# EAGLE design CVI06A (EAGLE 6.5.0)
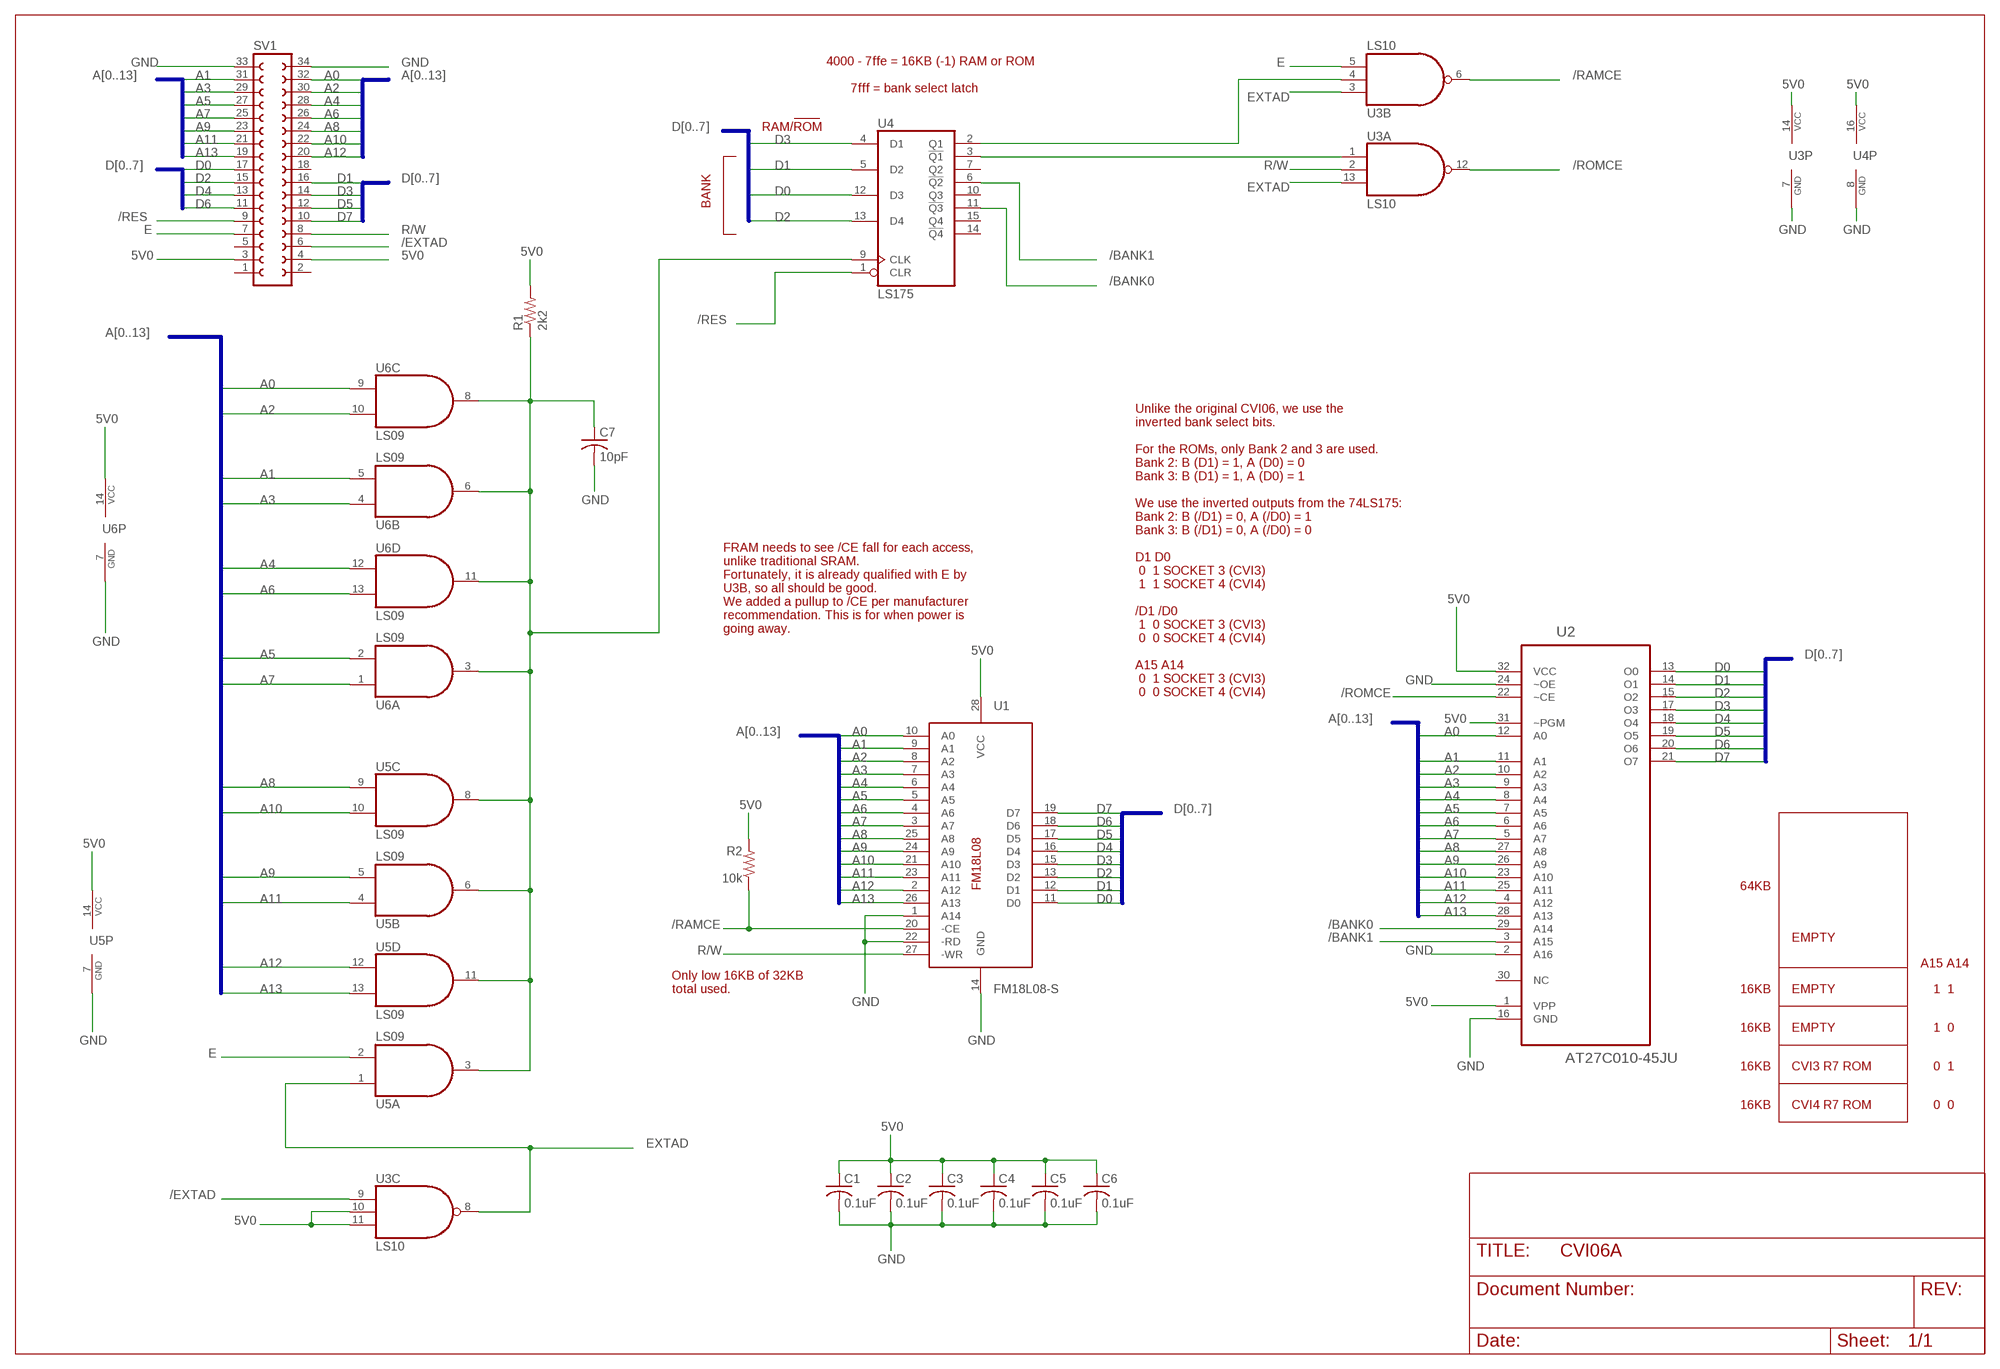
[diagram p0: schematic, sheet 1]

## Parts
C1  0.1uF  C-USC0603K  [C0603K]
C2  0.1uF  C-USC0603K  [C0603K]
C3  0.1uF  C-USC0603K  [C0603K]
C4  0.1uF  C-USC0603K  [C0603K]
C5  0.1uF  C-USC0603K  [C0603K]
C6  0.1uF  C-USC0603K  [C0603K]
C7  10pF  C-USC0805  [C0805]
R1  2k2  R-US_R0805  [R0805]
R2  10k  R-US_R0805  [R0805]
SV1  FE17-2  [FE17-2]
U1  FM18L08-S  [SO-28W]
U2  AT27C010-45JU  [PLCC127P1500X1250X355-32N]
U3  LS10  74ALS10D  [SO14]
U4  LS175  74LS175D  [SO16]
U5  LS09  74ALS09D  [SO14]
U6  LS09  74ALS09D  [SO14]

## Nets
5V0: C1.1 C2.1 C3.1 C4.1 C5.1 C6.1 R1.2 R2.2 SV1.3 SV1.4 U1.28(VCC) U2.1(VPP) U2.31(~PGM) U2.32(VCC) U3.10(C:I1) U3.11(C:I2) U3.14(P:VCC) U4.16(VCC) U5.14(P:VCC) U6.14(P:VCC)
/BANK0: U2.29(A14) U4.11(!Q3)
/BANK1: U2.3(A15) U4.6(!Q2)
/EXTAD: SV1.6 U3.9(C:I0)
/RAMCE: R2.1 U1.20(-CE) U3.6(B:O)
/RES: SV1.9 U4.1(CLR)
/ROMCE: U2.22(~CE) U3.12(A:O)
A0: SV1.32 U1.10(A0) U2.12(A0) U6.9(C:I0)
A1: SV1.31 U1.9(A1) U2.11(A1) U6.5(B:I1)
A2: SV1.30 U1.8(A2) U2.10(A2) U6.10(C:I1)
A3: SV1.29 U1.7(A3) U2.9(A3) U6.4(B:I0)
A4: SV1.28 U1.6(A4) U2.8(A4) U6.12(D:I0)
A5: SV1.27 U1.5(A5) U2.7(A5) U6.2(A:I1)
A6: SV1.26 U1.4(A6) U2.6(A6) U6.13(D:I1)
A7: SV1.25 U1.3(A7) U2.5(A7) U6.1(A:I0)
A8: SV1.24 U1.25(A8) U2.27(A8) U5.9(C:I0)
A9: SV1.23 U1.24(A9) U2.26(A9) U5.5(B:I1)
A10: SV1.22 U1.21(A10) U2.23(A10) U5.10(C:I1)
A11: SV1.21 U1.23(A11) U2.25(A11) U5.4(B:I0)
A12: SV1.20 U1.2(A12) U2.4(A12) U5.12(D:I0)
A13: SV1.19 U1.26(A13) U2.28(A13) U5.13(D:I1)
D0: SV1.17 U1.11(D0) U2.13(O0) U4.12(D3)
D1: SV1.16 U1.12(D1) U2.14(O1) U4.5(D2)
D2: SV1.15 U1.13(D2) U2.15(O2) U4.13(D4)
D3: SV1.14 U1.15(D3) U2.17(O3) U4.4(D1)
D4: SV1.13 U1.16(D4) U2.18(O4)
D5: SV1.12 U1.17(D5) U2.19(O5)
D6: SV1.11 U1.18(D6) U2.20(O6)
D7: SV1.10 U1.19(D7) U2.21(O7)
E: SV1.7 U3.5(B:I2) U5.2(A:I1)
EXTAD: U3.3(B:I0) U3.8(C:O) U3.13(A:I2) U5.1(A:I0)
GND: C1.2 C2.2 C3.2 C4.2 C5.2 C6.2 C7.2 SV1.33 SV1.34 U1.1(A14) U1.14(GND) U1.22(-RD) U2.2(A16) U2.16(GND) U2.24(~OE) U3.7(P:GND) U4.8(GND) U5.7(P:GND) U6.7(P:GND)
N$1: C7.1 R1.1 U4.9(CLK) U5.3(A:O) U5.6(B:O) U5.8(C:O) U5.11(D:O) U6.3(A:O) U6.6(B:O) U6.8(C:O) U6.11(D:O)
N$2: U3.4(B:I1) U4.2(Q1)
N$3: U3.1(A:I0) U4.3(!Q1)
R/W: SV1.8 U1.27(-WR) U3.2(A:I1)
Unconnected: SV1.1 SV1.2 SV1.5 SV1.18 U2.30(NC) U4.7(Q2) U4.10(Q3) U4.14(!Q4) U4.15(Q4)

## Buses
D[0..7]
A[0..13]

## Notes on the sheet
- 4000 - 7ffe = 16KB (-1) RAM or ROM
  
         7fff = bank select latch
- RAM/ROM
- BANK
- FRAM needs to see /CE fall for each access,
  unlike traditional SRAM.
  Fortunately, it is already qualified with E by
  U3B, so all should be good.
  We added a pullup to /CE per manufacturer
  recommendation. This is for when power is
  going away.
- Unlike the original CVI06, we use the
  inverted bank select bits.
  
  For the ROMs, only Bank 2 and 3 are used.
  Bank 2: B (D1) = 1, A (D0) = 0
  Bank 3: B (D1) = 1, A (D0) = 1
  
  We use the inverted outputs from the 74LS175:
  Bank 2: B (/D1) = 0, A (/D0) = 1
  Bank 3: B (/D1) = 0, A (/D0) = 0
  
  D1 D0
   0  1 SOCKET 3 (CVI3)
   1  1 SOCKET 4 (CVI4)
  
  /D1 /D0
   1  0 SOCKET 3 (CVI3)
   0  0 SOCKET 4 (CVI4)
  
  A15 A14
   0  1 SOCKET 3 (CVI3)
   0  0 SOCKET 4 (CVI4)
- 64KB
- EMPTY
- A15 A14
- Only low 16KB of 32KB
  total used.
- 16KB | EMPTY | 1  1
- 16KB | EMPTY | 1  0
- 16KB | CVI3 R7 ROM | 0  1
- 16KB | CVI4 R7 ROM | 0  0

## Library data of the parts
C1-C7 = rcl:C-US: CAPACITOR, American symbol
R1 R2 = rcl:R-US_: RESISTOR, American symbol
SV1 = con-lsta:FE17-2: FEMALE HEADER; OC_FARNELL: unknown; OC_NEWARK: unknown
U1 = ramtron-2:FM18L08: FM18L08 32k x 8 NVRAM 3V (Jedec) DIP/SO-28W
U2 = Atmel_By_element14_Batch_1:AT27C010-45JU: 1-Megabit OTP EPROM; DESCRIPTION: 1-Megabit OTP EPROM; MPN: AT27C010-45JU; OC_FARNELL: 1455018; OC_NEWARK: 58M3817; PACKAGE: PLCC-32; SUPPLIER: Atmel
U3 = 74xx-us:74*10: Triple 3-input NAND gate
U4 = 74xx-us:74*175: Qadruple D type FLIP FLOP, clear
U5 U6 = 74xx-us:74*09: Quad 2-input AND gate, open collector

## Board
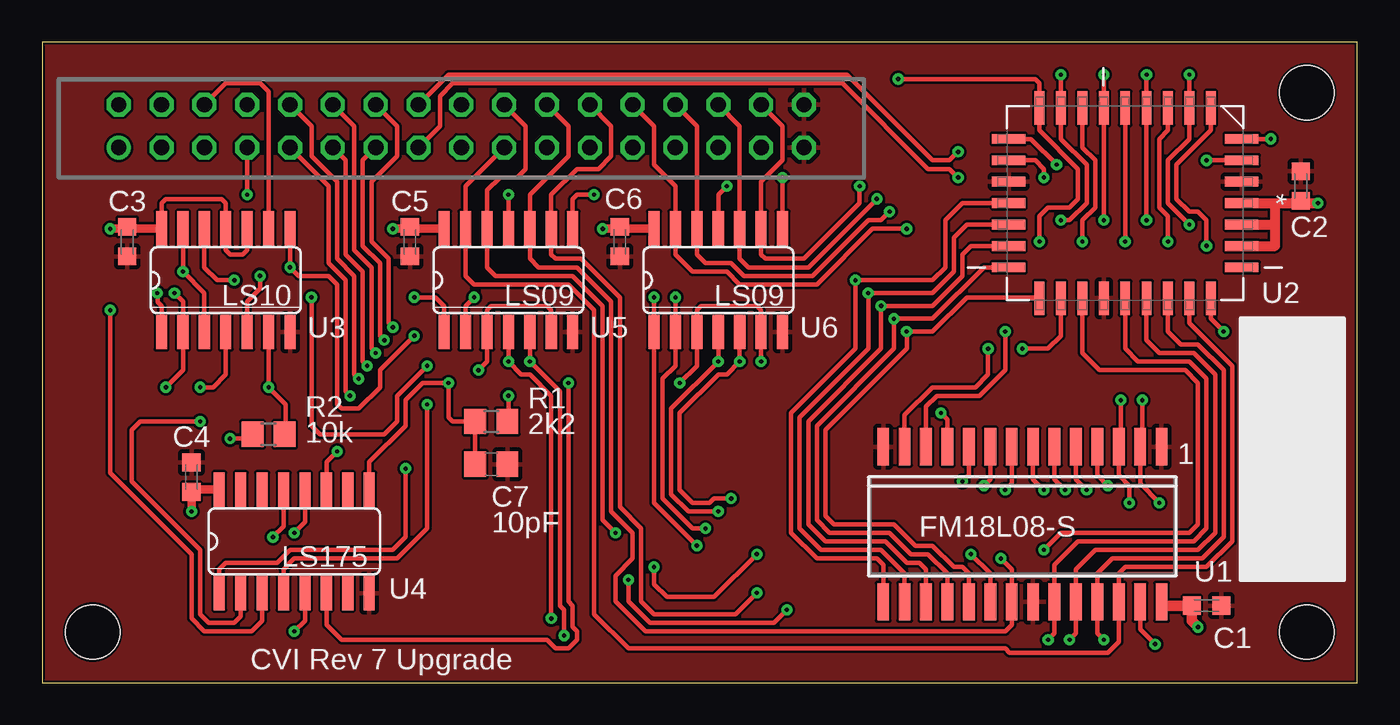
[diagram p1: board, top side]
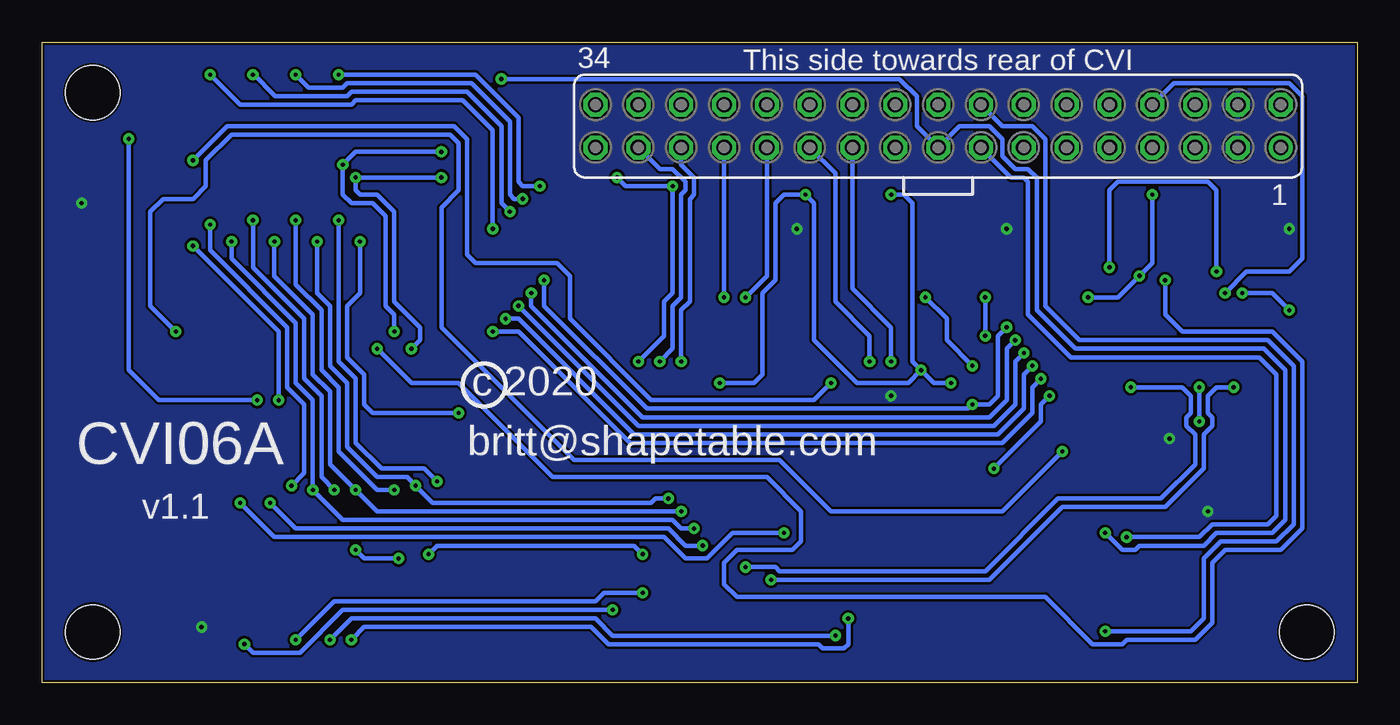
[diagram p2: board, bottom side, seen from below]

Size 78 x 38 mm. Coordinates in mm from the lower left corner, seen from the top.
Outline: 0,0 78,0 78,38 0,38 0,0
Copper layers (1*16): Top 0.035mm / dielectric 1.5mm / Bottom 0.035mm
Design rules "default *": minimum track width 6mil, minimum drill 10mil, track to track 6mil, track to pad 6mil, pad to pad 6mil, via to via 6mil, smd to smd 6mil, copper to edge 6mil, drill to drill 6mil, minimum pad ring 10mil, minimum via ring 8mil, stop-mask expansion 4mil, vias tented up to drill 10mil, thermal gap 10mil
Holes 3.2 mm at 75,35 75,3 3,3

### Footprints (pad centres in the part's own frame; a part is rotated, then mirrored left to right if it is on the bottom)
C0603K = smd 1.05 x 1.08: 1 -0.875,0; 2 0.875,0
C0805 = smd 1.3 x 1.5: 1 -0.95,0; 2 0.95,0
R0805 = smd 1.3 x 1.5: 1 -0.95,0; 2 0.95,0
FE17-2 = drill 0.914: 1 -20.32,1.27 | drill 0.914 octagon: 2 -20.32,-1.27; 3 -17.78,1.27; 4 -17.78,-1.27; 5 -15.24,1.27; 6 -15.24,-1.27; 7 -12.7,1.27; 8 -12.7,-1.27; 9 -10.16,1.27; 10 -10.16,-1.27; 11 -7.62,1.27; 12 -7.62,-1.27; 13 -5.08,1.27; 14 -5.08,-1.27; 15 -2.54,1.27; 16 -2.54,-1.27; 17 0,1.27; 18 0,-1.27; 19 2.54,1.27; 20 2.54,-1.27; 21 5.08,1.27; 22 5.08,-1.27; 23 7.62,1.27; 24 7.62,-1.27; 25 10.16,1.27; 26 10.16,-1.27; 27 12.7,1.27; 28 12.7,-1.27; 29 15.24,1.27; 30 15.24,-1.27; 31 17.78,1.27; 32 17.78,-1.27; 33 20.32,1.27; 34 20.32,-1.27
SO-28W = smd 0.7 x 2.2: 1 -8.255,-4.6; 2 -6.985,-4.6; 3 -5.715,-4.6; 4 -4.445,-4.6; 5 -3.175,-4.6; 6 -1.905,-4.6; 7 -0.635,-4.6; 8 0.635,-4.6; 9 1.905,-4.6; 10 3.175,-4.6; 11 4.445,-4.6; 12 5.715,-4.6; 13 6.985,-4.6; 14 8.255,-4.6; 15 8.255,4.6; 16 6.985,4.6; 17 5.715,4.6; 18 4.445,4.6; 19 3.175,4.6; 20 1.905,4.6; 21 0.635,4.6; 22 -0.635,4.6; 23 -1.905,4.6; 24 -3.175,4.6; 25 -4.445,4.6; 26 -5.715,4.6; 27 -6.985,4.6; 28 -8.255,4.6
PLCC127P1500X1250X355-32N = smd 0.584 x 1.981: 1 0,6.909; 2 -1.27,6.909; 3 -2.54,6.909; 4 -3.81,6.909; 14 -3.81,-6.909; 15 -2.54,-6.909; 16 -1.27,-6.909; 17 0,-6.909; 18 1.27,-6.909; 19 2.54,-6.909; 20 3.81,-6.909; 30 3.81,6.909; 31 2.54,6.909; 32 1.27,6.909 | smd 1.981 x 0.584: 5 -5.639,5.08; 6 -5.639,3.81; 7 -5.639,2.54; 8 -5.639,1.27; 9 -5.639,0; 10 -5.639,-1.27; 11 -5.639,-2.54; 12 -5.639,-3.81; 13 -5.639,-5.08; 21 5.639,-5.08; 22 5.639,-3.81; 23 5.639,-2.54; 24 5.639,-1.27; 25 5.639,0; 26 5.639,1.27; 27 5.639,2.54; 28 5.639,3.81; 29 5.639,5.08
SO14 = smd 0.66 x 2.032: 1 -3.81,-3.073; 2 -2.54,-3.073; 3 -1.27,-3.073; 4 0,-3.073; 5 1.27,-3.073; 6 2.54,-3.073; 7 3.81,-3.073; 8 3.81,3.073; 9 2.54,3.073; 10 1.27,3.073; 11 0,3.073; 12 -1.27,3.073; 13 -2.54,3.073; 14 -3.81,3.073
SO16 = smd 0.66 x 2.032: 1 -4.445,-3.073; 2 -3.175,-3.073; 3 -1.905,-3.073; 4 -0.635,-3.073; 5 0.635,-3.073; 6 1.905,-3.073; 7 3.175,-3.073; 8 4.445,-3.073; 9 4.445,3.073; 10 3.175,3.073; 11 1.905,3.073; 12 0.635,3.073; 13 -0.635,3.073; 14 -1.905,3.073; 15 -3.175,3.073; 16 -4.445,3.073

### Placement (x,y rotation side)
C1  69.06,4.57 0 top
C2  74.64,29.46 90 top
C3  5.05,26.16 270 top
C4  8.86,12.19 90 top
C5  21.81,26.16 270 top
C6  34.26,26.16 270 top
C7  26.64,12.95 0 top
R1  26.64,15.49 0 top
R2  13.43,14.73 180 top
SV1  24.86,33.02 180 bottom
U1  58.13,9.4 180 top
U2  64.23,28.45 270 top
U3  10.89,23.88 0 top
U4  14.95,8.38 0 top
U5  27.65,23.88 0 top
U6  40.1,23.88 0 top

### Tracks (layer width: path | path; a pad name or v marks a point on that pad's centre or on a via)
5V0  (via drill 0.25)
  Top 0.254: U3.14 7.08,28.45 7.33,28.7 10.64,28.7 10.89,28.45 U3.11 10.89,25.65 11.14,25.4 11.91,25.4 12.16,25.65 U3.10 | R1.2 27.65,15.49 v27.65,17.02 | R2.2 12.23,14.48 v11.14,14.48
  Top 0.508: v8.86,10.16 8.86,11.43 8.72,11.43 C4.1 8.86,11.46 U4.16 | 7.08,26.81 U3.14 5.05,26.95 C3.1 5.05,26.92 v4.03,26.92 | v20.8,26.92 21.7,26.92 C5.1 21.9,26.95 U5.14 | v33.24,26.92 34.15,26.92 C6.1 34.35,26.95 U6.14
  Top 0.584: U2.1 73.12,28.45 | 73.12,28.45 74.64,28.45 | C2.1 74.64,28.45 | 74.64,28.45 v75.66,28.45 | U2.32 73.12,27.18 | 73.12,27.18 73.12,28.45 | U2.31 73.12,25.91 73.12,27.18
  Top 0.61: U1.28 66.39,4.57
  Top 0.635: v68.55,3.3 68.18,3.67 C1.1 66.39,4.57
  pour Bottom: 0,0 0,38.1 78.2,38.1 78.2,0
/BANK0  (via drill 0.25)
  Top 0.254: U4.11 16.86,13.08 v17.49,13.72 | v70.07,20.83 69.31,21.59 U2.29
  Bottom 0.254: v17.49,13.72 21.05,10.16 31.21,10.16 34.26,13.21 46.45,13.21 54.32,21.08 54.32,28.19 53.31,29.21 53.31,32 53.82,32.51 66.77,32.51 68.29,30.99 68.29,29.46 69.06,28.7 70.83,28.7 71.6,27.94 71.6,22.35 v70.07,20.83
/BANK1  (via drill 0.25)
  Top 0.254: U2.3 v69.06,30.99 | v31.21,17.78 31.21,4.83 31.46,4.57 31.46,3.3 31.72,3.05 31.72,2.54 31.21,2.03 30.45,2.03 29.94,2.54 17.75,2.54 16.86,3.43 U4.6
  Bottom 0.254: v69.06,30.99 67.02,33.02 53.56,33.02 52.8,32.26 52.8,25.4 52.29,24.89 47.47,24.89 46.7,24.13 46.7,21.59 41.88,16.76 32.23,16.76 v31.21,17.78
/EXTAD
  Top 0.254: SV1.6 10.89,35.56 12.92,35.56 13.43,35.05 U3.9
/RAMCE  (via drill 0.25)
  Top 0.254: v36.29,6.86 36.29,5.84 37.05,5.08 39.85,5.08 v42.39,7.62 | U3.6 v13.43,17.53 14.45,16.51 14.45,14.8 R2.1 | v55.09,7.62 56.23,6.48 U1.20
  Bottom 0.254: v36.29,6.86 34.51,6.86 34.26,6.6 22.07,6.6 17.75,10.92 11.65,10.92 9.62,12.95 9.62,14.73 10.13,15.24 10.13,15.75 9.87,16 9.87,17.02 10.38,17.53 v13.43,17.53 | v42.39,7.62 42.89,8.13 54.58,8.13 v55.09,7.62
/RES  (via drill 0.25)
  Top 0.254: U4.1 10.51,6.73 10.89,7.11 13.94,7.11 14.7,7.87 20.8,7.87 21.56,8.64 v21.56,12.7 | SV1.9 16.99,29.46 16.99,24.89 18,23.88 18,17.27 v18.26,17.02
  Bottom 0.254: v21.56,12.7 18.76,15.49 18.76,16.51 v18.26,17.02
/ROMCE  (via drill 0.25)
  Top 0.254: U3.12 9.62,24.64 10.38,23.88 v11.4,23.88 | v58.13,19.81 59.66,19.81 60.42,20.57 U2.22
  Bottom 0.254: v11.4,23.88 11.4,21.84 10.38,20.83 5.05,20.83 3.27,19.05 3.27,9.14 4.54,7.87 7.84,7.87 8.6,7.11 8.6,3.56 9.62,2.54 13.68,2.54 13.94,2.29 15.72,2.29 18.51,5.08 36.8,5.08 37.56,5.84 37.56,7.11 36.8,7.87 33.5,7.87 32.99,8.38 32.99,10.16 35.02,12.19 47.72,12.19 53.31,17.78 56.1,17.78 v58.13,19.81
A0  (via drill 0.25)
  Top 0.254: v60.42,27.43 60.93,27.43 61.94,28.45 61.94,30.73 60.42,32.26 U2.12 v60.42,36.07 | SV1.32 43.91,33.02 43.91,30.99 42.64,29.72 U6.9 42.64,25.4 42.89,25.15 45.18,25.15 48.48,28.45 v48.48,29.46 | U1.10 54.96,12.32 v54.58,11.94
  Bottom 0.254: v60.42,27.43 60.42,19.05 59.4,18.03 59.4,14.22 57.88,12.7 55.34,12.7 v54.58,11.94 | v48.48,29.46 49.5,29.46 49.75,29.72 49.75,33.53 52.29,36.07 v60.42,36.07
A1  (via drill 0.25)
  Top 0.254: U2.11 61.69,31.75 62.45,30.99 62.45,28.19 61.69,27.43 v61.69,26.16 | U6.5 v41.37,19.05 40.61,18.29 40.1,18.29 37.81,16 37.81,11.43 38.58,10.67 39.59,10.67 39.85,10.92 v40.86,10.92 | U1.9 56.23,12.06 v55.85,11.68
  Bottom 0.254: v61.69,26.16 61.69,23.11 60.93,22.35 60.93,18.8 59.91,17.78 59.91,13.97 58.13,12.19 56.36,12.19 v55.85,11.68 54.83,10.67 41.88,10.67 41.62,10.92 v40.86,10.92 | SV1.31 41.37,30.48 40.61,30.48 39.85,29.72 39.85,29.21 40.1,28.96 40.1,22.86 40.61,22.35 40.61,19.81 v41.37,19.05
A2  (via drill 0.25)
  Top 0.254: v62.96,27.43 U2.10 v62.96,36.07 | SV1.30 41.37,33.02 U6.10 41.37,25.15 41.88,24.64 45.43,24.64 v49.5,28.7 | U1.8 57.5,11.81 v57.12,11.43
  Bottom 0.254: v62.96,27.43 62.96,23.62 61.44,22.1 61.44,18.54 60.42,17.53 60.42,13.72 58.13,11.43 v57.12,11.43 | v49.5,28.7 50.01,28.7 50.26,28.96 50.26,33.27 52.55,35.56 59.91,35.56 60.17,35.31 62.2,35.31 v62.96,36.07
A3  (via drill 0.25)
  Top 0.254: U2.9 v64.23,26.16 | U6.4 v40.1,19.05 37.31,16.26 37.31,11.18 38.32,10.16 v40.1,10.16 | U1.7 58.77,12.06 v59.4,11.43
  Bottom 0.254: v64.23,26.16 64.23,24.13 61.94,21.84 61.94,18.29 60.93,17.27 60.93,12.95 v59.4,11.43 58.13,10.16 v40.1,10.16 | SV1.29 40.1,30.73 39.34,29.97 39.34,28.96 39.59,28.7 39.59,22.61 40.1,22.1 v40.1,19.05
A4  (via drill 0.25)
  Top 0.254: v65.5,27.43 U2.8 v65.5,36.07 | SV1.28 38.83,33.02 U6.12 38.83,25.4 39.34,24.89 40.86,24.89 41.62,24.13 45.69,24.13 48.99,27.43 49.75,27.43 v50.26,27.94 | U1.6 60.04,12.06 v60.67,11.43
  Bottom 0.254: v65.5,27.43 65.5,24.64 62.45,21.59 62.45,18.03 61.44,17.02 61.44,12.19 v60.67,11.43 | v50.26,27.94 50.77,28.45 50.77,33.02 52.8,35.05 59.66,35.05 59.91,34.8 64.18,34.8 65.5,36.12 v65.5,36.07
A5  (via drill 0.25)
  Top 0.254: U2.7 66.77,32.77 66.26,32.26 66.26,28.19 66.77,27.69 v66.77,26.16 | v37.56,22.86 U6.2 37.56,18.8 36.8,18.03 36.8,10.92 38.58,9.14 v39.34,9.14 | v61.94,11.43 61.31,12.06 U1.5
  Bottom 0.254: v66.77,26.16 66.77,25.15 62.96,21.34 62.96,17.78 61.94,16.76 v61.94,11.43 60.17,9.65 40.61,9.65 40.1,9.14 v39.34,9.14 | SV1.27 v37.56,22.86
A6  (via drill 0.25)
  Top 0.254: v68.04,27.18 66.77,28.45 66.77,30.99 68.04,32.26 U2.6 v68.04,36.07 | SV1.26 36.29,33.02 36.29,30.73 37.56,29.46 U6.13 37.56,25.4 38.58,24.38 40.61,24.38 41.37,23.62 45.94,23.62 49.24,26.92 v51.28,26.92 | v63.21,11.68 62.58,12.32 U1.4
  Bottom 0.254: v68.04,27.18 68.04,25.65 63.47,21.08 63.47,17.53 62.45,16.51 62.45,12.45 v63.21,11.68 | v51.28,26.92 51.28,32.77 53.05,34.54 59.4,34.54 59.66,34.29 66.26,34.29 v68.04,36.07
A7  (via drill 0.25)
  Top 0.254: U2.5 69.31,32.77 67.28,30.73 67.28,28.7 68.04,27.94 68.55,27.94 69.06,27.43 v69.06,25.91 | v36.29,22.86 U6.1 36.29,10.67 v38.83,8.13 | v63.98,16.76 63.98,14.12 U1.3 63.85,12.32 64.48,11.68 v64.48,10.67
  Bottom 0.254: v69.06,25.91 63.98,20.83 v63.98,16.76 | SV1.25 35.02,24.13 v36.29,22.86 | v38.83,8.13 39.85,8.13 40.86,9.14 62.96,9.14 v64.48,10.67
A8  (via drill 0.25)
  Top 0.254: SV1.24 33.75,33.02 33.75,31.24 32.99,30.48 31.72,30.48 30.19,28.96 U5.9 30.19,25.4 30.45,25.15 31.97,25.15 34.26,22.86 34.26,10.41 35.53,9.14 35.53,4.83 36.29,4.06 41.12,4.06 v42.39,5.33 | U2.27 66.77,20.83 67.53,20.07 68.55,20.07 70.07,18.54 70.07,8.64 68.8,7.37 63.47,7.37 62.58,6.48 U1.25 62.58,2.92 v62.96,2.54
  Bottom 0.254: v42.39,5.33 44.67,5.33 45.18,4.83 60.67,4.83 v62.96,2.54
A9  (via drill 0.25)
  Top 0.254: U5.5 v28.92,19.05 30.7,17.27 30.7,4.57 30.96,4.32 v30.96,2.79 | U2.26 65.5,20.32 66.26,19.56 68.29,19.56 69.56,18.29 69.56,8.89 68.55,7.87 62.45,7.87 61.31,6.73 U1.24 61.31,2.92 v60.93,2.54
  Bottom 0.254: SV1.23 30.96,30.23 30.96,22.61 28.92,20.57 v28.92,19.05 | v60.93,2.54 59.66,3.81 45.18,3.81 44.16,2.79 v30.96,2.79
A10  (via drill 0.25)
  Top 0.254: SV1.22 31.21,33.02 31.21,31.24 28.92,28.96 U5.10 28.92,25.15 29.43,24.64 31.72,24.64 33.75,22.61 33.75,10.16 35.02,8.89 35.02,7.37 34,6.35 34,4.83 35.78,3.05 57.12,3.05 57.5,3.43 U1.21 57.5,6.73 v56.86,7.37 | U2.23 61.69,19.56 62.71,18.54 67.79,18.54 68.55,17.78 68.55,9.4 68.04,8.89 60.42,8.89 v59.4,7.87
  Bottom 0.254: v59.4,7.87 58.9,7.37 v56.86,7.37
A11  (via drill 0.25)
  Top 0.254: U5.4 v27.65,19.05 28.42,18.29 28.92,18.29 30.19,17.02 v30.19,3.81 | U2.25 64.23,19.81 64.99,19.05 68.04,19.05 69.06,18.03 69.06,9.14 68.29,8.38 61.44,8.38 60.04,6.99 U1.23 60.04,2.92 v59.66,2.54
  Bottom 0.254: SV1.21 29.94,23.37 27.65,21.08 v27.65,19.05 | v59.66,2.54 58.9,3.3 45.43,3.3 44.42,2.29 31.97,2.29 31.72,2.03 30.45,2.03 30.19,2.29 v30.19,3.81
A12  (via drill 0.25)
  Top 0.254: SV1.20 28.67,33.02 28.67,30.48 28.16,29.97 27.15,29.97 26.38,29.21 U5.12 26.38,24.64 26.89,24.13 31.46,24.13 33.24,22.35 33.24,9.65 v34,8.89 | v72.87,32.26 U2.4 70.83,32.26 | v65.25,16.76 65.25,14.12 U1.2 65.12,11.81 v66.26,10.67
  Bottom 0.254: v65.25,16.76 71.09,16.76 72.87,18.54 v72.87,32.26 | v34,8.89 37.05,8.89 38.58,7.37 39.85,7.37 41.12,8.64 64.23,8.64 v66.26,10.67
A13
  Top 0.254: SV1.19 25.11,29.46 U5.13 25.11,24.13 25.62,23.62 31.21,23.62 32.73,22.1 32.73,4.06 34.77,2.03 57.12,2.03 57.37,1.78 63.21,1.78 63.85,2.41 U1.26 63.85,6.48 64.23,6.86 69.06,6.86 70.58,8.38 70.58,18.8 68.04,21.34 U2.28
D0  (via drill 0.25)
  Top 0.254: v59.15,26.16 59.15,27.69 59.66,28.19 60.93,28.19 61.44,28.7 61.44,30.48 59.15,32.77 U2.13 59.15,35.56 58.9,35.81 v50.77,35.81 | v14.95,8.89 15.59,9.53 U4.12 | U1.11 53.69,15.62 v53.31,16
  Bottom 0.254: v59.15,26.16 59.15,23.11 59.91,22.35 59.91,19.3 58.9,18.29 58.9,16.51 58.39,16 v53.31,16 | v14.95,8.89 13.94,7.87 13.18,7.87 12.92,8.13 9.11,8.13 8.35,8.89 5.05,8.89 4.29,9.65 4.29,18.54 5.56,19.81 16.73,19.81 19.02,22.1 19.02,29.97 19.53,30.48 20.29,30.48 21.05,31.24 21.05,32.26 21.81,33.02 23.59,33.02 SV1.17 26.13,33.02 26.13,34.8 27.15,35.81 v50.77,35.81
D1  (via drill 0.25)
  Top 0.254: SV1.16 24.1,36.07 47.72,36.07 52.8,30.99 53.82,30.99 v54.32,31.5 | v14.95,3.05 15.59,3.68 U4.5 | U1.12 52.42,16.38 53.05,17.02 55.59,17.02 57.12,18.54 v57.12,20.83 | U2.14 58.64,32.26 v60.17,30.73
  Bottom 0.254: v57.12,20.83 57.12,21.84 57.63,22.35 57.63,27.69 58.39,28.45 59.66,28.45 60.17,28.96 v60.17,30.73 59.4,31.5 v54.32,31.5 | SV1.16 21.05,33.02 19.27,33.02 18.51,32.26 18.51,22.35 16.48,20.32 5.3,20.32 3.78,18.8 3.78,9.4 4.79,8.38 8.1,8.38 9.11,7.37 9.11,3.81 9.87,3.05 v14.95,3.05
D2  (via drill 0.25)
  Top 0.254: v13.68,8.64 14.32,9.27 U4.13 | SV1.15 23.59,33.02 23.59,34.8 24.35,35.56 47.47,35.56 52.55,30.48 53.82,30.48 v54.32,29.97 | v56.1,19.81 56.1,18.29 55.34,17.53 52.8,17.53 51.15,15.88 U1.13 | U2.15 58.9,30.99 59.4,30.48 v59.4,29.97
  Bottom 0.254: v56.1,19.81 55.59,20.32 55.59,21.08 57.12,22.61 57.12,27.94 58.13,28.96 59.15,28.96 59.4,29.21 v59.4,29.97 v54.32,29.97 | SV1.15 20.54,29.97 19.78,29.97 19.53,29.72 19.53,21.84 16.99,19.3 5.81,19.3 4.79,18.29 4.79,9.91 5.3,9.4 8.6,9.4 9.37,8.64 v13.68,8.64
D3  (via drill 0.25)
  Top 0.254: U2.17 54.58,28.45 53.56,27.43 53.56,24.64 52.8,23.88 v48.23,23.88 48.23,19.81 44.42,16 44.42,8.89 45.94,7.37 49.5,7.37 49.88,6.99 U1.15 | SV1.14 21.05,33.02 21.05,31.24 19.53,29.72 19.53,26.16 20.54,25.15 20.54,21.34 v20.8,21.08 | U4.4 14.32,6.73 14.95,7.37 21.05,7.37 22.83,9.14 v22.83,16.51
  Bottom 0.254: v20.8,21.08 21.3,20.57 21.3,17.02 21.81,16.51 v22.83,16.51 23.08,16.26 42.13,16.26 48.23,22.35 v48.23,23.88
D4  (via drill 0.25)
  Top 0.254: U2.18 54.83,27.18 54.07,26.42 54.07,24.38 52.8,23.11 v48.99,23.11 48.99,19.81 44.93,15.75 44.93,9.14 46.2,7.87 49.75,7.87 51.15,6.48 U1.16 | SV1.13 19.02,30.99 19.02,25.91 20.03,24.89 20.03,20.57 v20.29,20.32
  Bottom 0.254: v20.29,20.32 20.8,19.81 20.8,16.76 21.81,15.75 42.39,15.75 48.99,22.35 v48.99,23.11
D5  (via drill 0.25)
  Top 0.254: U2.19 55.09,25.91 54.58,25.4 54.58,24.13 52.8,22.35 v49.75,22.35 49.75,19.81 45.43,15.49 45.43,9.4 46.45,8.38 50.01,8.38 51.28,7.11 52.04,7.11 52.42,6.73 U1.17 | SV1.12 18.51,33.02 18.51,25.65 19.53,24.64 19.53,19.81 v19.78,19.56
  Bottom 0.254: v19.78,19.56 20.29,19.05 20.29,16.51 21.56,15.24 42.64,15.24 v49.75,22.35
D6  (via drill 0.25)
  Top 0.254: U2.20 55.85,24.64 52.8,21.59 v50.51,21.59 50.51,19.81 45.94,15.24 45.94,9.65 46.7,8.89 50.26,8.89 51.53,7.62 52.55,7.62 53.69,6.48 U1.18 | SV1.11 18,30.99 18,25.4 19.02,24.38 19.02,19.05 v19.27,18.8
  Bottom 0.254: v19.27,18.8 19.78,18.29 19.78,16.26 21.3,14.73 42.89,14.73 49.75,21.59 v50.51,21.59
D7  (via drill 0.25)
  Top 0.254: U2.21 59.1,22.86 54.83,22.86 52.8,20.83 v51.28,20.83 51.28,19.81 46.45,14.99 46.45,9.91 46.96,9.4 50.51,9.4 51.78,8.13 52.8,8.13 54.07,6.86 54.58,6.86 54.96,6.48 U1.19 | SV1.10 15.97,33.02 15.97,31.24 17.49,29.72 17.49,25.15 18.51,24.13 18.51,18.29 v18.76,18.03
  Bottom 0.254: v18.76,18.03 19.27,17.53 19.27,16 21.05,14.22 43.15,14.22 49.75,20.83 v51.28,20.83
E  (via drill 0.25)
  Top 0.254: v12.92,24.13 12.92,23.37 12.16,22.61 U3.5 | v22.83,18.8 21.05,17.02 21.05,15.49 20.29,14.73 16.48,14.73 15.97,15.24 v15.97,22.86 | U5.2 25.11,22.35 v25.62,22.86 | SV1.7 v12.16,28.96
  Bottom 0.254: v15.97,22.86 14.19,22.86 v12.92,24.13 12.16,24.89 v12.16,28.96 | v25.62,22.86 24.35,21.59 24.35,20.32 v22.83,18.8
EXTAD  (via drill 0.25)
  Top 0.254: U3.3 9.62,23.11 v8.35,24.38 U3.13 | U3.8 v14.7,24.64 15.21,24.13 16.99,24.13 17.49,23.62 17.49,16.51 17.75,16.26 18.76,16.26 20.03,17.53 20.03,18.54 v22.07,20.57 | v22.07,22.86 23.34,22.86 23.84,22.35 U5.1
  Bottom 0.254: v8.35,24.38 8.35,29.21 8.86,29.72 14.19,29.72 14.7,29.21 v14.7,24.64 | v22.07,20.57 v22.07,22.86
GND
  pour Top: 0,0 0,38.1 78.2,38.1 78.2,0
N$1  (via drill 0.25)
  Top 0.254: v42.64,19.05 U6.6 42.64,22.1 42.39,22.35 39.08,22.35 38.83,22.1 U6.3 38.83,18.8 v37.81,17.78 | v43.91,29.97 U6.8 | U5.6 30.19,22.1 29.94,22.35 26.64,22.35 26.38,22.1 U5.3 26.38,19.05 v25.88,18.54 | U5.11 v27.65,28.96 | v32.73,28.96 31.72,28.96 31.46,28.7 U5.8 | U6.11 40.1,28.96 v40.61,29.46 | U4.9 19.4,13.08 21.56,15.24 21.56,16.76 22.57,17.78 v24.1,17.78 24.1,15.75 24.35,15.49 25.56,15.49 25.62,15.56 R1.1 C7.1
  Bottom 0.254: v27.65,28.96 26.89,28.96 26.38,28.45 26.38,19.05 v25.88,18.54 | v25.88,18.54 26.64,17.78 29.69,17.78 32.23,20.32 32.23,28.45 v32.73,28.96 34,28.96 34.51,28.45 34.51,23.88 35.27,23.11 35.27,18.29 35.78,17.78 v37.81,17.78 | v43.91,29.97 43.4,29.46 v40.61,29.46 40.61,23.11 41.12,22.61 41.12,20.57 v42.64,19.05 | v25.88,18.54 25.11,17.78 v24.1,17.78
N$2  (via drill 0.25)
  Top 0.254: U4.2 11.78,3.94 11.4,3.56 9.87,3.56 9.37,4.06 9.37,7.87 5.3,11.94 5.3,14.99 5.81,15.49 v9.37,15.49 | v9.37,17.53 10.13,17.53 10.89,18.29 U3.4
  Bottom 0.254: v9.37,15.49 v9.37,17.53
N$3  (via drill 0.25)
  Top 0.254: U4.3 13.05,3.68 12.41,3.05 9.62,3.05 8.86,3.81 8.86,7.62 4.03,12.45 v4.03,22.1 | v6.83,23.11 6.85,23.09 6.85,22.58 7.08,22.35 U3.1
  Bottom 0.254: v4.03,22.1 5.05,23.11 v6.83,23.11
R/W  (via drill 0.25)
  Top 0.254: v7.84,23.11 8.35,22.61 U3.2 8.35,18.54 v7.33,17.53 | v34.77,6.1 34.77,4.83 36.04,3.56 43.4,3.56 v44.16,4.32 | v66.01,2.29 65.12,3.17 U1.27
  Bottom 0.254: v7.84,23.11 6.57,24.38 4.03,24.38 3.27,25.15 3.27,34.8 4.03,35.56 10.89,35.56 SV1.8 | v34.77,6.1 21.81,6.1 17.49,10.41 11.4,10.41 9.11,12.7 9.11,14.73 8.6,15.24 8.6,15.75 8.86,16 8.86,17.02 8.35,17.53 v7.33,17.53 | v44.16,4.32 60.17,4.32 62.71,1.78 65.5,1.78 v66.01,2.29

### Text on the board
tPlace: CVI Rev 7 Upgrade
bPlace: This side towards rear of CVI | c 2020 | CVI06A | britt@shapetable.com | v1.1